# Altium schematic sheet Input_Connectors.SchDoc
size A4; SheetNumber: 5; SheetTotal: 8
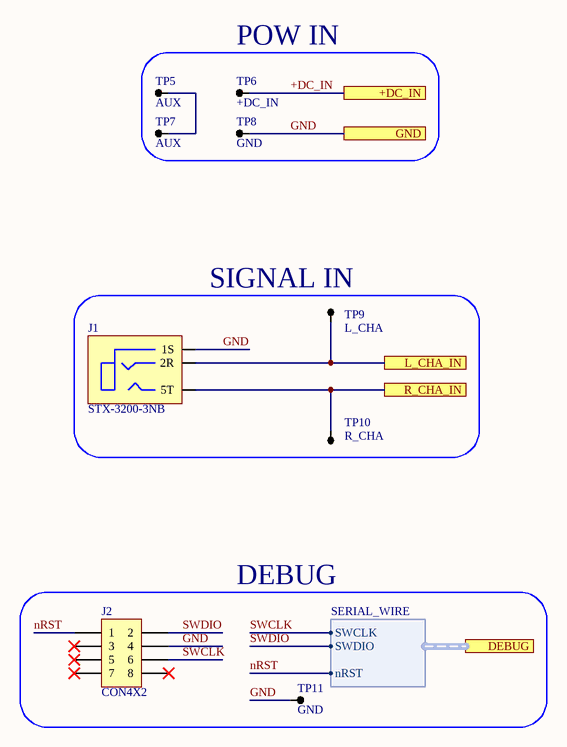
[diagram p0: Input_Connectors.SchDoc]

## Parts
J1  STX-3200-3NB  [JACK-3.5-3POS]
J2  CON4X2  [SIP4X2]
TP5  AUX  [534-5280]
TP6  +DC_IN  [534-5280]
TP7  AUX  [534-5280]
TP8  GND  [534-5280]
TP9  L_CHA  [534-5280]
TP10  R_CHA  [534-5280]
TP11  GND  [534-5280]

## Blocks framed on the sheet
POW IN: TP5-TP8
SIGNAL IN: J1 TP9 TP10
DEBUG: J2 TP11

## Ports
+DC_IN, DEBUG (harness SERIAL_WIRE), GND, L_CHA_IN, R_CHA_IN

## Harnesses
SERIAL_WIRE: SWCLK, SWDIO, nRST

## Nets
+DC_IN: TP6.1 ; port +DC_IN
GND: J1.1S J2.4 TP8.1 TP11.1 ; port GND
L_CHA_IN: J1.2R TP9.1 ; port L_CHA_IN
nRST: J2.1 ; port DEBUG.nRST
R_CHA_IN: J1.5T TP10.1 ; port R_CHA_IN
SWCLK: J2.6 ; port DEBUG.SWCLK
SWDIO: J2.2 ; port DEBUG.SWDIO
NetTP5_1: TP5.1 TP7.1

Not connected (* = marked no-connect by the designer): J2 3* 5* 7* 8*

## Library data of the parts
TP5-TP11 = TP-CLAW